# Altium schematic sheet mcu.SchDoc: Teensy 3.2 MCU
size A4; Organization: OSU Robotics Club; Address1: www.osurobotics.club; Address2: Rover Team; DocumentNumber: 4; SheetNumber: 4; SheetTotal: 6
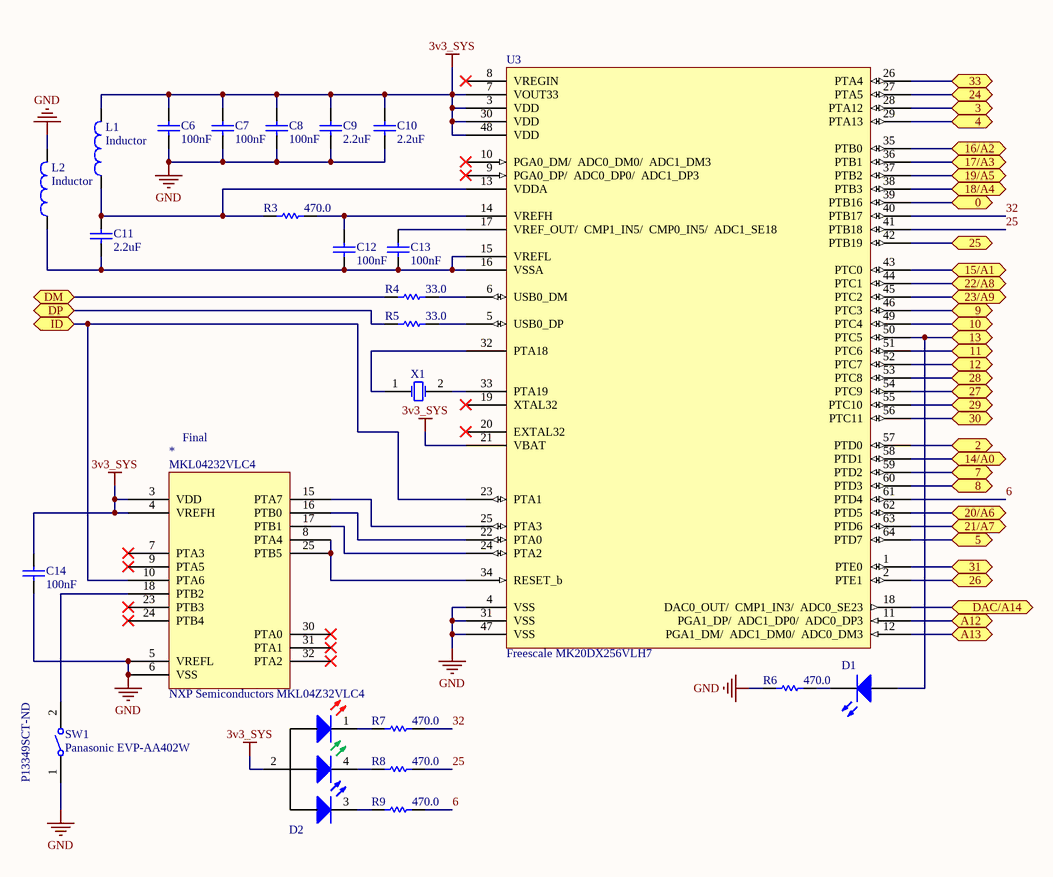
[diagram p0: mcu.SchDoc]

## Parts
*  NXP Semiconductors MKL04Z32VLC4  [PCB-knvfj40gtsopk5lc2mhb-1]
C6  Capacitance: 100nF  [PCB-3a53f7g8nqmmfsudd9tf-1]  (hidden comment: Murata GRM219R71C104KA01D)
C7  Capacitance: 100nF  [PCB-3a53f7g8nqmmfsudd9tf-1]  (hidden comment: Murata GRM219R71C104KA01D)
C8  Capacitance: 100nF  [PCB-3a53f7g8nqmmfsudd9tf-1]  (hidden comment: Murata GRM219R71C104KA01D)
C9  Capacitance: 2.2uF  [CAPC2013X135X45ML10T25]  (hidden comment: Murata GRM21BR71A225KA01K)
C10  Capacitance: 2.2uF  [CAPC2013X135X45ML10T25]  (hidden comment: Murata GRM21BR71A225KA01K)
C11  Capacitance: 2.2uF  [CAPC2013X135X45ML10T25]  (hidden comment: Murata GRM21BR71A225KA01K)
C12  Capacitance: 100nF  [PCB-3a53f7g8nqmmfsudd9tf-1]  (hidden comment: Murata GRM219R71C104KA01D)
C13  Capacitance: 100nF  [PCB-3a53f7g8nqmmfsudd9tf-1]  (hidden comment: Murata GRM219R71C104KA01D)
C14  Capacitance: 100nF  [PCB-3a53f7g8nqmmfsudd9tf-1]  (hidden comment: Murata GRM219R71C104KA01D)
D1  SYM-cf0a07c59f6310cd-1  [PCB-q13q7q9xcpj9ke5g4s5g-1]  (value not drawn)
D2  CLV1A-FKB-CHMKPEHBB7A363  [PCBComponent_1 - duplicate]  (value not drawn)
L1  Inductor  [PCB-t3fao6t093bi50uq2f8t-1]
L2  Inductor  [PCB-t3fao6t093bi50uq2f8t-1]
R3  470.0  [R0603_A]
R4  Resistance: 33.0  [PCB-9ahxsq8gddjqcnfjmojj-1]  (hidden comment: Stackpole Electronics RMCF0603FT33R0)
R5  Resistance: 33.0  [PCB-9ahxsq8gddjqcnfjmojj-1]  (hidden comment: Stackpole Electronics RMCF0603FT33R0)
R6  470.0  [R0603_A]
R7  470.0  [R0603_A]
R8  470.0  [R0603_A]
R9  470.0  [R0603_A]
SW1  Panasonic EVP-AA402W  [PCB-ckecs2qu15uytlwr89so-1]
U3  Freescale MK20DX256VLH7  [MCHP-TQFP-PT64_N]
X1  AVX CX2520DB16000D0GEJCC  [PCB-gvpu1da98qnonvqyvako-1]  (value not drawn)

## Ports
0 (bidir), 2 (bidir), 3 (bidir), 4 (bidir), 5 (bidir), 7 (bidir), 8 (bidir), 9 (bidir), 10 (bidir), 11 (bidir), 12 (bidir), 13 (bidir), 14/A0 (bidir), 15/A1 (bidir), 16/A2 (bidir), 17/A3 (bidir), 18/A4 (bidir), 19/A5 (bidir), 20/A6 (bidir), 21/A7 (bidir), 22/A8 (bidir), 23/A9 (bidir), 24 (bidir), 25 (bidir), 26 (bidir), 27 (bidir), 28 (bidir), 29 (bidir), 30 (bidir), 31 (bidir), 33 (bidir), A12 (bidir), A13 (bidir), DAC/A14, DM (bidir), DP (bidir), ID (bidir)

## Nets
3v3_SYS: *.3(VDD) *.4(VREFH) C6.1 C7.1 C8.1 C9.1 C10.1 C14.1 D2.2(A) L1.2 U3.3(VDD) U3.7(VOUT33) U3.21(VBAT) U3.30(VDD) U3.48(VDD)
GND: *.5(VREFL) *.6(VSS) C6.2 C7.2 C8.2 C9.2 C10.2 C14.2 L2.2 R6.1 SW1.1 U3.4(VSS) U3.31(VSS) U3.47(VSS)
0: U3.39(PTB16) ; port 0
2: U3.57(PTD0) ; port 2
3: U3.28(PTA12) ; port 3
4: U3.29(PTA13) ; port 4
5: U3.64(PTD7) ; port 5
6: R9.2 U3.61(PTD4)
7: U3.59(PTD2) ; port 7
8: U3.60(PTD3) ; port 8
9: U3.46(PTC3) ; port 9
10: U3.49(PTC4) ; port 10
11: U3.51(PTC6) ; port 11
12: U3.52(PTC7) ; port 12
13: D1.2(A) U3.50(PTC5) ; port 13
14/A0: U3.58(PTD1) ; port 14/A0
15/A1: U3.43(PTC0) ; port 15/A1
16/A2: U3.35(PTB0) ; port 16/A2
17/A3: U3.36(PTB1) ; port 17/A3
18/A4: U3.38(PTB3) ; port 18/A4
19/A5: U3.37(PTB2) ; port 19/A5
20/A6: U3.62(PTD5) ; port 20/A6
21/A7: U3.63(PTD6) ; port 21/A7
22/A8: U3.44(PTC1) ; port 22/A8
23/A9: U3.45(PTC2) ; port 23/A9
24: U3.27(PTA5) ; port 24
25: R8.2 U3.41(PTB18)
25: U3.42(PTB19) ; port 25  [a separate net that carries the same name]
26: U3.2(PTE1) ; port 26
27: U3.54(PTC9) ; port 27
28: U3.53(PTC8) ; port 28
29: U3.55(PTC10) ; port 29
30: U3.56(PTC11) ; port 30
31: U3.1(PTE0) ; port 31
32: R7.2 U3.40(PTB17)
33: U3.26(PTA4) ; port 33
A12: U3.11(PGA1_DP/__ADC1_DP0/__ADC0_DP3) ; port A12
A13: U3.12(PGA1_DM/__ADC1_DM0/__ADC0_DM3) ; port A13
DAC/A14: U3.18(DAC0_OUT/__CMP1_IN3/__ADC0_SE23) ; port DAC/A14
DM: R4.1 ; port DM
DP: R5.1 ; port DP
ID: *.10(PTA6) U3.23(PTA1) ; port ID
Net*_8: *.8(PTA4) *.25(PTB5) U3.34(RESET_b)
Net*_15: *.15(PTA7) U3.25(PTA3)
Net*_16: *.16(PTB0) U3.22(PTA0)
Net*_17: *.17(PTB1) U3.24(PTA2)
Net*_18: *.18(PTB2) SW1.2
NetC11_1: C11.1 L1.1 R3.1 U3.13(VDDA)
NetC11_2: C11.2 C12.2 C13.2 L2.1 U3.15(VREFL) U3.16(VSSA)
NetC12_1: C12.1 R3.2 U3.14(VREFH)
NetC13_1: C13.1 U3.17(VREF_OUT/__CMP1_IN5/__CMP0_IN5/__ADC1_SE18)
NetD1_1: D1.1(K) R6.2
NetD2_1: D2.1(K) R7.1
NetD2_3: D2.3(K) R9.1
NetD2_4: D2.4(K) R8.1
NetR4_2: R4.2 U3.6(USB0_DM)
NetR5_2: R5.2 U3.5(USB0_DP)
NetU3_32: U3.32(PTA18) X1.1(OSC1)
NetU3_33: U3.33(PTA19) X1.2(OSC2)

Not connected (* = marked no-connect by the designer): * 7(PTA3)* 9(PTA5)* 23(PTB3)* 24(PTB4)* 30(PTA0)* 31(PTA1)* 32(PTA2)*; U3 8(VREGIN)* 9(PGA0_DP/__ADC0_DP0/__ADC1_DP3)* 10(PGA0_DM/__ADC0_DM0/__ADC1_DM3)* 19(XTAL32)* 20(EXTAL32)*

## Notes on the sheet
- Final
- (near SW1) P13349SCT-ND
- Title
- Size:
- Date:
- A4
- Engineer:
- Time:
- Sheet
- Revision:
- of
- File:
- (in symbol CMP-2f56e26cbf0df091-3) MKL04232VLC4

## Library data of the parts
* = CMP-2f56e26cbf0df091-3: MCU 32-bit Kinetis KL04 ARM Cortex M0+ RISC 32KB Flash 1.8V/2.5V/3.3V 32-Pin LQFP Tray; Lead-Free Status: Lead Free; Octopart URL: https://octopart.com/mkl04z32vlc4-nxp+semiconductors-70300989; Manufacturer Part Number: MKL04Z32VLC4; Halogen Free Status: Halogen Free; Lifecycle Status: Active; Mounting Style: Surface Mount; Operating Temperature: -40.0 °C to 105 °C; RoHS: Compliant; OctopartID: 2f56e26cbf0df091
C6-C8 C12-C14 = CMP-f3963a9e29dd2c51-2: 0805 0.1 uF 16 V ±10 % Tolerance X7R Surface Mount Multilayer Ceramic Capacitor; Capacitance Tolerance: ±10%; Case/Package (SI): 2012; Voltage Rating (DC): 16.0 V; Lead-Free Status: Lead Free; OctopartID: f3963a9e29dd2c51; Size-Width: 0.00125 m; Mounting Style: Surface Mount; Octopart URL: http://octopart.com/grm219r71c104ka01d-murata-196397; Size-Thickness: 0.00085 m; Case/Package: 0805; Manufacturer Part Number: GRM219R71C104KA01D; Lifecycle Status: Active; Size-Length: 0.002 m; Size-Height: 0.00085 m; RoHS: Compliant; Dielectric Characteristic: X7R
C9-C11 = CMP-136462-2: CAP CER 2.2UF 10V 10% X7R 0805; Case/Package (SI): 2012; Voltage Rating (DC): 10.0 V; Capacitance Tolerance: ±10%; Case/Package: 0805; Dielectric Characteristic: X7R; Lifecycle Status: Active; Octopart Url: https://octopart.com/grm21br71a225ka01k-murata-10689975; OctopartID: 9a7053d9a2a145b7; RoHS: Compliant; Size-Length: 0.002 m; Size-Thickness: 0.00125 m; Size-Width: 0.00125 m
D1 = CMP-12518856-3: LED, 0603, BLUE, 145MCD, 470NM; Bulb Size: -; LED Colour: Bleu; Luminous Intensity; Manufacturer Part Number: 150060BS75000; Viewing Angle: 140 °; Online Catalog: 0603 Rectangle with Flat Top Chip LEDs; Wavelength - Peak: 465nm; Voltage - Forward (Vf) (Typ): 3.2V; Current - Test: 20mA; 3D Model: SMCW_0603.igsSMCW_0603.stpSMCW_0603.wrl; Lens Style/Size: Rectangle with Flat Top, 1.1mm x 0.7mm; Lens Type: Clear; Other Names: 732-4966-2; Forward Voltage: 3.20 V; Color: Blue; Mounting Style: Surface Mount; Luminous Intensity: 145 mcd; Octopart URL: http://octopart.com/150060bs75000-w%C3%BCrth+elektronik-29717775; Case/Package: 0603; REACH SVHC Compliance: No SVHC; Size / Dimension: 1.60mm L x 0.80mm W; Height: 0.70mm; Ciiva URL: https://ciiva.com/part/150060BS75000-12518856; Family: LED Indication - Discrete; Category: Optoelectronics; Wavelength - Dominant: 470nm; Millicandela Rating: 145mcd; Mounting Type: Surface Mount; Package / Case: 0603 (1608 Metric); Series: WL-SMCW; Dynamic Catalog: 0603 Rectangle with Flat Top Chip LEDs; CiivaID: 12518856; Standard Package: 4,000; Packaging: Tape & Reel (TR); Packaging: Cut Tape (CT); OctopartID: cf0a07c59f6310cd; RoHS: Compliant
D2 = CMP-ab39631138c174fe-2: LED Tri-Color Blue/Green/Red 4-Pin PLCC T/R; Viewing Angle: 120 °; RoHS: Compliant; Number of Pins: 4; Octopart URL: http://octopart.com/clv1a-fkb-chmkpehbb7a363-cree-19052190; Packaging: Cut Tape (CT); OctopartID: ab39631138c174fe; Manufacturer Part Number: CLV1A-FKB-CHMKPEHBB7A363
L1 L2 = CMP-0b78c357e86dd4bf-1: Ferrite Bead (Chip Bead), 1.6 x 0.8 x 0.8mm (0603), 453Ohms impedance at 25 MHz; Manufacturer Part Number: HZ0603B102R-10; Lead-Free Status: Lead Free; Frequency: 100 MHz; Case/Package (SI): 1608; OctopartID: 0b78c357e86dd4bf; REACH SVHC Compliance: No SVHC; Size-Height: 800 µm; Case/Package: 0603; RoHS: Compliant; Octopart URL: http://octopart.com/hz0603b102r-10-laird-19252851; Size-Width: 800 µm
R3 R6-R9 = CMP-d59d1ef5e9b70a5a-2: RC Series 0603 0.1 W 470 Ohms 5% ±100 ppm/°C SMT Thick Film Chip Resistor; Manufacturer Part Number: RC0603JR-07470RL; Power Rating: 0.1 W; Voltage Rating (DC): 50.0 V; Lead-Free Status: Lead Free; Size-Length: 0.0016 m; Case/Package: 0603; OctopartID: d59d1ef5e9b70a5a; Resistance Tolerance: ±5%; RoHS: Compliant; Seller Landing  Url: https://octopart-clicks.com/click/track?country=US&ak=8157f166&sig=054c9ec&sid=5489&ppid=39983436&vpid=190517122&ct=offers; Number of Pins: 2; Size-Width: 0.0008 m; Resistance: 470.0; REACH SVHC Compliance: No SVHC; Mounting Style: Surface Mount; Octopart Url: http://octopart.com/rc0603jr-07470rl-yageo-39983436; Size-Height: 0.00045 m
R4 R5 = CMP-88ab408486b9576c-1: Res Thick Film 0603 33 Ohm 1% 0.1W(1/10W) ??100ppm/??C Molded SMD Paper T/R; Power Rating: 100 mW; Octopart URL: https://octopart.com/rmcf0603ft33r0-stackpole+electronics-19213172; Manufacturer Part Number: RMCF0603FT33R0; Case/Package: 0603; Mounting Style: Surface Mount; Packaging: Tape & Reel (TR); Resistance Tolerance: ±1%; RoHS: Compliant; OctopartID: 88ab408486b9576c
SW1 = CMP-a8006355e18477c7-1: Switch Tactile N.O. SPST Rectangular Button J-Bend 0.02A 15VDC 2.4N SMD Embossed T/R; Actuator Type: Standard; Contact Current Rating: 20.0 mA; Contact Resistance: 100 m? (max); Contacts Type: SPST-NO; Lead-Free Status: Lead Free; Octopart URL: https://octopart.com/evp-aa402w-panasonic-39808226; Manufacturer Part Number: EVP-AA402W; Lifecycle Status: Not Listed by Manufacturer; Mounting Style: Surface Mount; Operating Temperature: 85.0 °C (max); Orientation: Vertical; Packaging: Tape & Reel (TR); RoHS: Compliant; Size-Length: 3.50 mm; Size-Width: 2.90 mm; OctopartID: a8006355e18477c7
U3 = CMP-3247417-12: ARM Microcontrollers - MCU KINETIS 256K (Teensy_vx); Manufacturer: Freescale Semiconductor; Operating Supply Voltage: 1.71 V to 3.6 V; Maximum Clock Frequency: 72 MHz; Unit Weight: 0.012224 oz; Data RAM Size: 32 kB; Core: ARM Cortex M4; Data Bus Width: 32 bit; Processor Series: K20; Program Memory Size: 256 kB; On-Chip ADC: Yes; Footprint: PCB-hu01hgjk4hs1btyr9sn0-1; RoHS: Details; Series: K20_72; Package / Case: LQFP-64; Manufacturer Part Number: MK20DX256VLH7; Ciiva URL: https://ciiva.com/part/mk20dx256vlh7-3247417; Factory Pack Quantity: 160; Brand: Freescale Semiconductor; CiivaID: 3247417; Product Category: ARM Microcontrollers - MCU; Tradename: Kinetis; Maximum Operating Temperature: + 105 C; Operating Temperature Range: - 40 C to + 105 C; Mounting Style: SMD/SMT; Packaging: Tray; Minimum Operating Temperature: - 40 C
X1 = CMP-c54c0e17e8f91a8b-1: Crystal 16MHz ±15ppm (Tol) ±15ppm (Stability) 8pF FUND 100Ohm 4-Pin CSMD T/R; Load Capacitance: 8.00 pF; Octopart URL: http://octopart.com/cx2520db16000d0gejcc-avx-38865107; Manufacturer Part Number: CX2520DB16000D0GEJCC; Packaging: Reel; RoHS: Compliant; Mounting Style: Surface Mount; OctopartID: c54c0e17e8f91a8b